# EAGLE design lab4 (EAGLE 7.6.0)
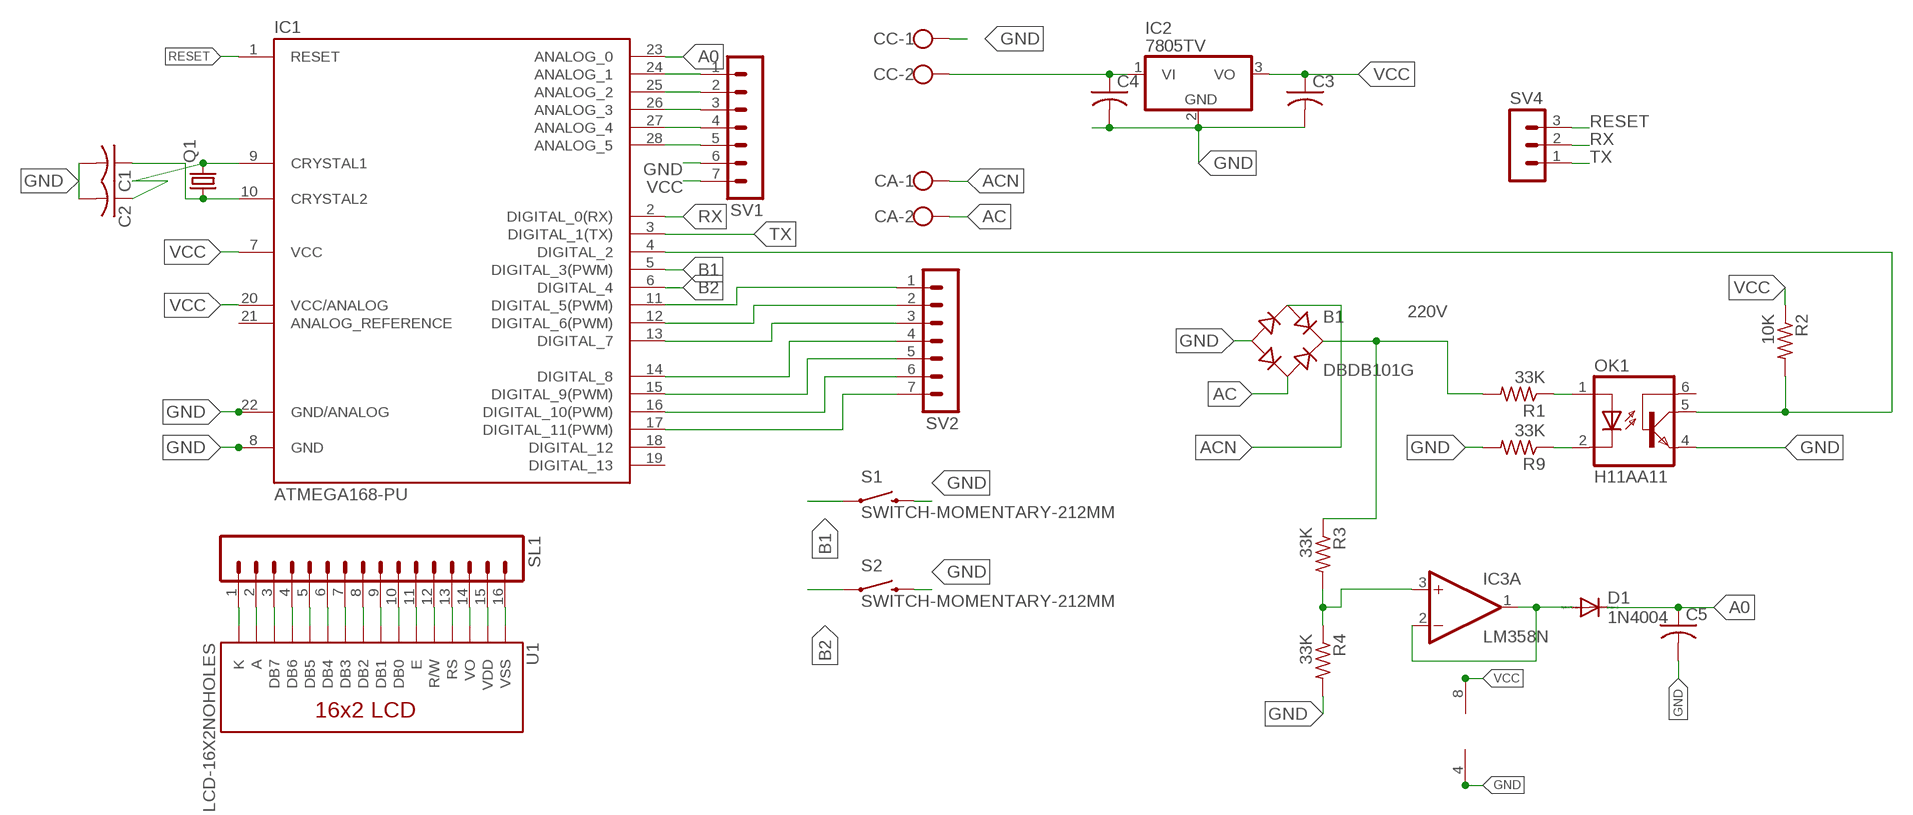
[diagram p0: schematic, sheet 1]

## Parts
B1  DBDB101G  [DB]
C1  C-US025-025X050  [C025-025X050]
C2  C-US025-025X050  [C025-025X050]
C3  C-US075-032X103  [C075-032X103]
C4  C-US050-025X075  [C050-025X075]
C5  C-US050-075X075  [C050-075X075]
CA  W237-102  [W237-102]
CC  W237-102  [W237-102]
D1  1N4004  [DO41-10]
IC1  ATMEGA168-PU  [DIL28-3]
IC2  7805TV  [TO220V]
IC3  LM358N  [DIL08]
OK1  H11AA11  [DIL06]
Q1  CRYSTALHC18U-V  [HC18U-V]
R1  33K  R-US_0207/7  [0207/7]
R2  10K  R-US_0309/12  [0309/12]
R3  33K  R-US_0207/7  [0207/7]
R4  33K  R-US_0207/7  [0207/7]
R9  33K  R-US_0207/7  [0207/7]
S1  SWITCH-MOMENTARY-212MM  [TACTILE-PTH-12MM]
S2  SWITCH-MOMENTARY-212MM  [TACTILE-PTH-12MM]
SL1  MA16  [16PA]
SV1  MA07-1  [MA07-1]
SV2  MA07-1  [MA07-1]
SV4  MA03-1  [MA03-1]
U1  LCD-16X2NOHOLES  [LCD-16X2_NOHOLES]

## Nets
220V: B1.+ R1.2 R3.1
A0: C5.1 D1.C IC1.23(ANALOG_0)
AC: B1.AC2 CA.2
ACN: B1.AC1 CA.1
B1: IC1.5(DIGITAL_3(PWM)) S1.1
B2: IC1.6(DIGITAL_4) S2.1
DIG02: IC1.4(DIGITAL_2) OK1.5(COL) R2.2
GND: B1.- C1.2 C2.2 C3.2 C4.2 C5.2 CC.1 IC1.8(GND) IC1.22(GND/ANALOG) IC2.2(GND) IC3.4(P:V-) OK1.4(EMI) R4.2 R9.2 S1.3 S2.3 SV1.6
N$1: IC1.24(ANALOG_1) SV1.1
N$2: D1.A IC3.1(A:OUT) IC3.2(A:-IN)
N$3: IC3.3(A:+IN) R3.2 R4.1
N$4: OK1.2(C) R9.1
N$5: IC1.11(DIGITAL_5(PWM)) SV2.1
N$6: OK1.1(A) R1.1
N$7: IC1.25(ANALOG_2) SV1.2
N$8: C2.1 IC1.9(CRYSTAL1) Q1.2
N$9: C1.1 IC1.10(CRYSTAL2) Q1.1
N$10: IC1.12(DIGITAL_6(PWM)) SV2.2
N$11: IC1.13(DIGITAL_7) SV2.3
N$12: C4.1 CC.2 IC2.1(VI)
N$13: IC1.14(DIGITAL_8) SV2.4
N$14: IC1.15(DIGITAL_9(PWM)) SV2.5
N$15: IC1.16(DIGITAL_10(PWM)) SV2.6
N$16: IC1.26(ANALOG_3) SV1.3
N$17: IC1.17(DIGITAL_11(PWM)) SV2.7
N$18: IC1.27(ANALOG_4) SV1.4
N$19: IC1.28(ANALOG_5) SV1.5
N$20: SL1.1 U1.16(K)
N$21: SL1.2 U1.15(A)
N$22: SL1.3 U1.14(DB7)
N$23: SL1.4 U1.13(DB6)
N$24: SL1.5 U1.12(DB5)
N$25: SL1.6 U1.11(DB4)
N$26: SL1.7 U1.10(DB3)
N$27: SL1.8 U1.9(DB2)
N$28: SL1.9 U1.8(DB1)
N$29: SL1.10 U1.7(DB0)
N$30: SL1.11 U1.6(E)
N$31: SL1.12 U1.5(R/W)
N$32: SL1.13 U1.4(RS)
N$33: SL1.14 U1.3(VO)
N$34: SL1.15 U1.2(VDD)
N$35: SL1.16 U1.1(VSS)
RESET: IC1.1(RESET) SV4.3
RX: IC1.2(DIGITAL_0(RX)) SV4.2
TX: IC1.3(DIGITAL_1(TX)) SV4.1
VCC: C3.1 IC1.7(VCC) IC1.20(VCC/ANALOG) IC2.3(VO) IC3.8(P:V+) R2.1 SV1.7
Unconnected: IC1.18(DIGITAL_12) IC1.19(DIGITAL_13) IC1.21(ANALOG_REFERENCE) IC3.5(B:+IN) IC3.6(B:-IN) IC3.7(B:OUT) OK1.6(BAS)

## Library data of the parts
B1 = rectifier:DB?*G: Single Phase 1.0 AMP Glass Passivated Bridge Rectifier Taiwan Semiconductor Co.,Ltd. - TSC Source: http://www.taiwansemi.com/TSCbig5/ezcatfiles/cust/img/img/db101g.pdf http://www.ts.com.tw/db/pictures/modules/PDT/PDT060207001/DBLS201G.pdf
C1-C5 = adafruit:C-US: CAPACITOR, American symbol
CA CC = con-wago-500:W237-102: WAGO SCREW CLAMP; MPN: 237-102; OC_FARNELL: unknown; OC_NEWARK: 70K9898
D1 = diode:1N4004: DIODE general purpose rectifier, 1 A
IC1 = Arduino-AVR:ATMEGA168-PU
IC2 = linear:78*: Positive VOLTAGE REGULATOR Source: http://cache.national.com/ds/LM/LM78L05.pdf http://www.fairchildsemi.com/ds/LM/LM7805.pdf
IC3 = linear:LM358: OP AMP also LM158; LM258; LM2904 Source: http://cache.national.com/ds/LM/LM158.pdf
OK1 = twomey:H11AA1: Optocoupler AC Input 1 Channel Trans W/Base DC Output 6-Pin DIP Source: http://www.jameco.com/webapp/wcs/stores/servlet/Product_10001_10001_18825_-1; MPN: H11A1-M; OC_FARNELL: 1021358; OC_NEWARK: 97K1793
Q1 = adafruit:CRYSTAL: CRYSTAL; OC_FARNELL: unknown; OC_NEWARK: unknown
R1-R4 R9 = adafruit:R-US_: RESISTOR, American symbol
S1 S2 = SparkFun-Electromechanical:SWITCH-MOMENTARY-2: Various NO switches- pushbuttons, reed, etc; PROD_ID: SWCH-09185
SL1 = con-amp-quick:MA16: AMP QUICK CONNECTOR; OC_FARNELL: unknown; OC_NEWARK: unknown
SV1 SV2 = con-lstb:MA07-1: PIN HEADER; OC_FARNELL: unknown; OC_NEWARK: unknown
SV4 = con-lstb:MA03-1: PIN HEADER; OC_FARNELL: unknown; OC_NEWARK: unknown
U1 = SparkFun-Displays:LCD-16X2: Standard text-only 16x2 parallel input LCD

## Board
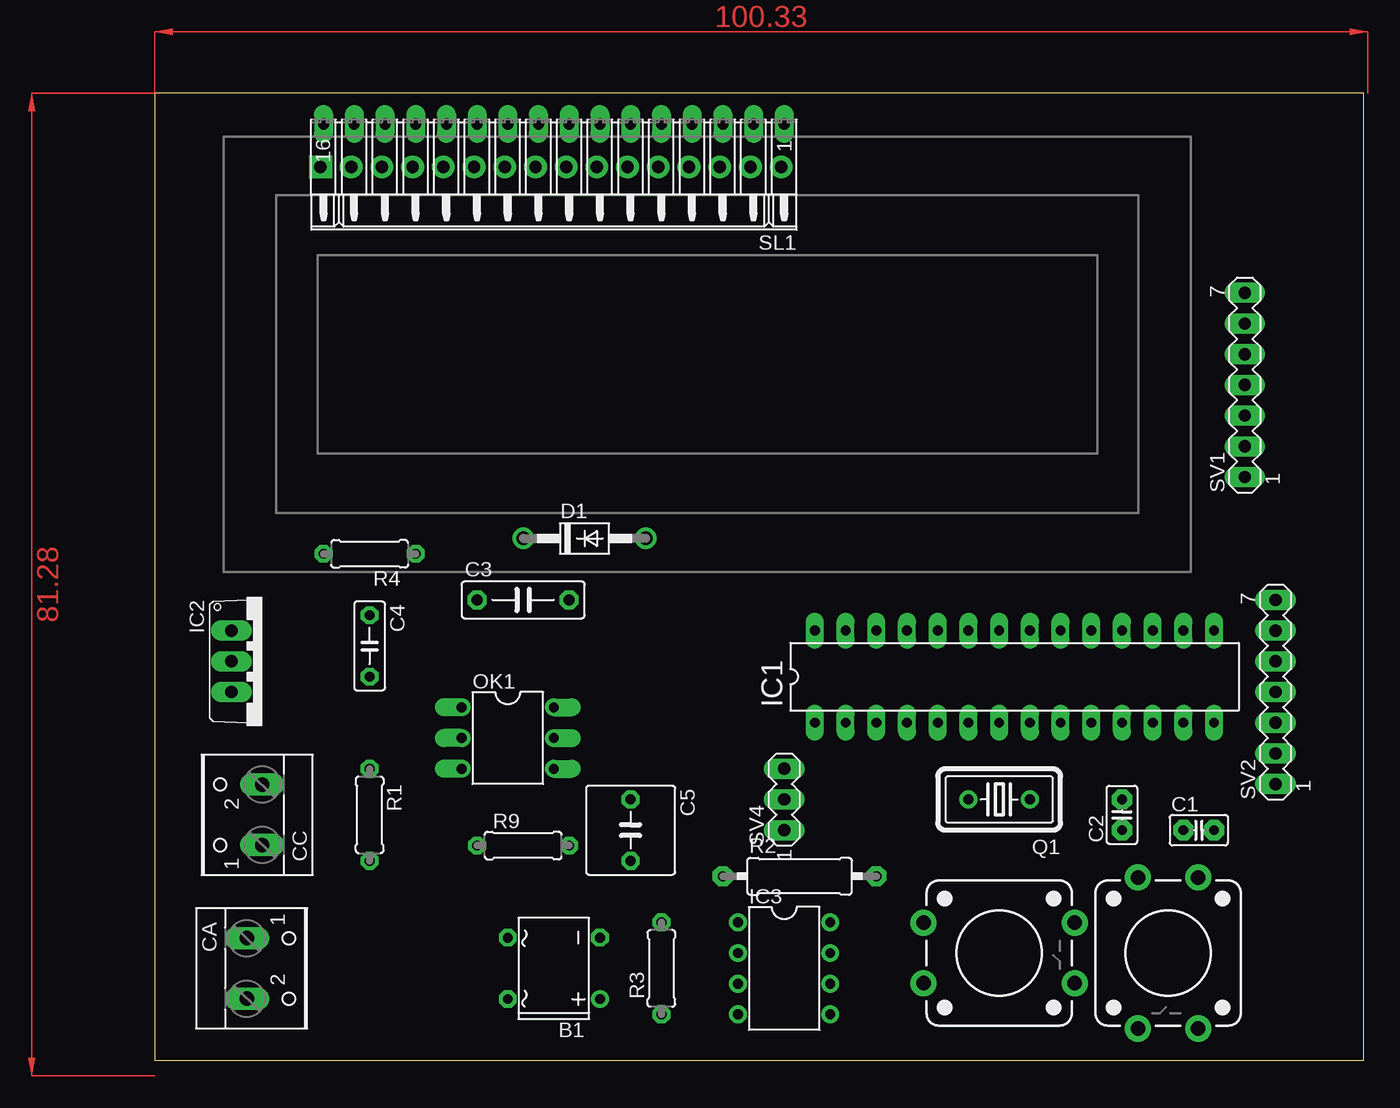
[diagram p1: board, top side]
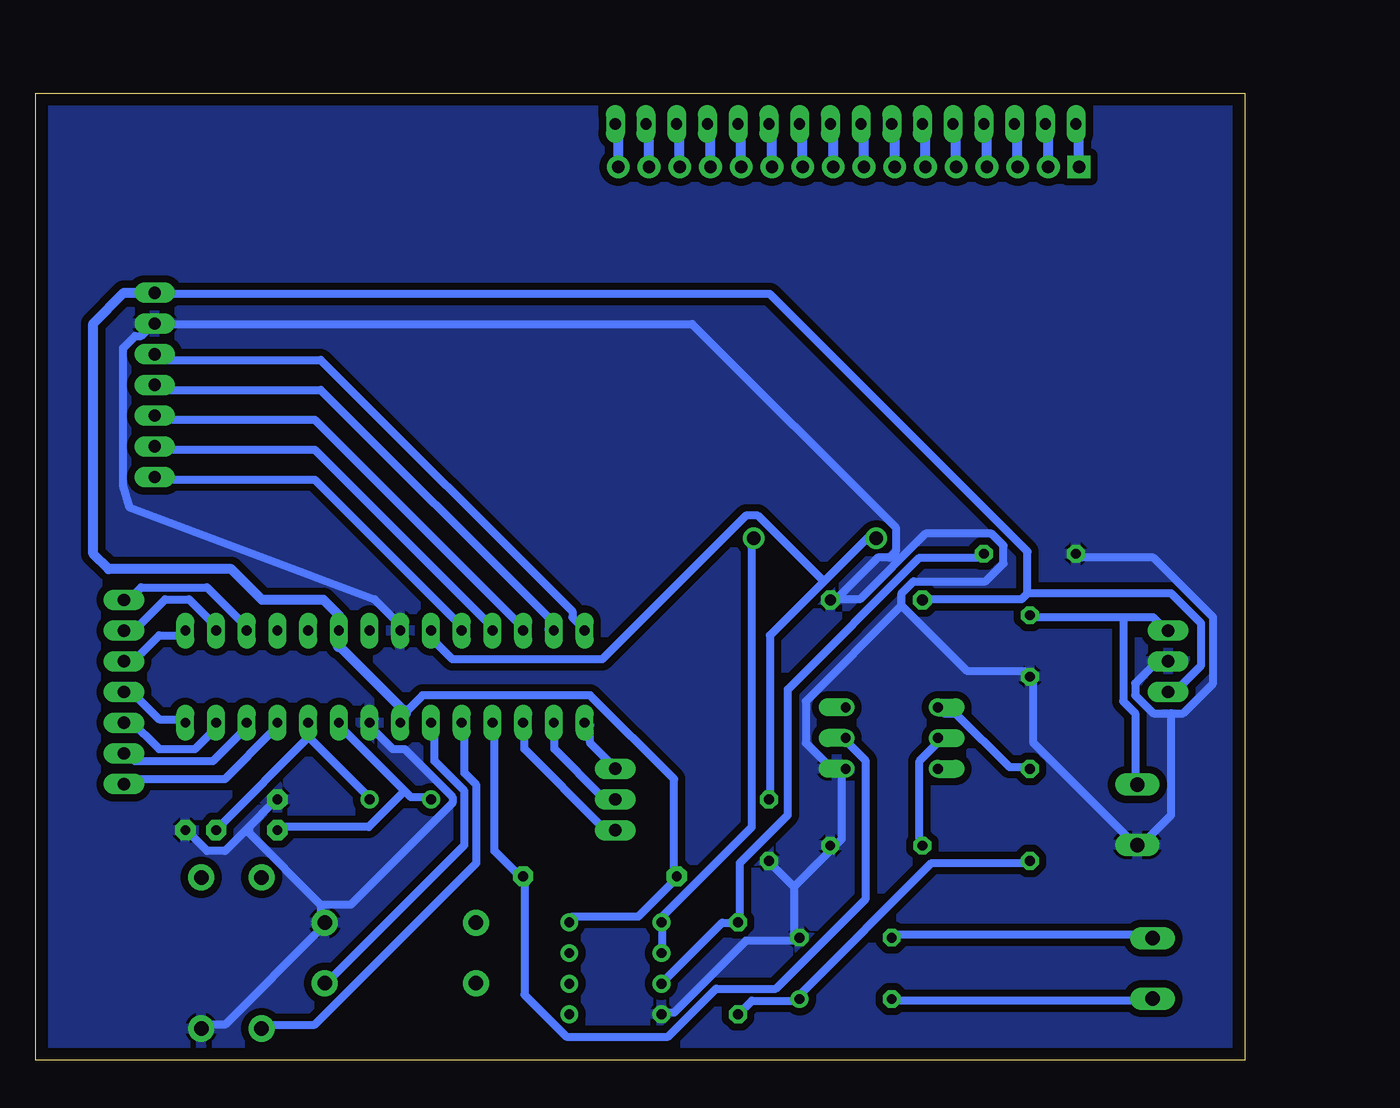
[diagram p2: board, bottom side, seen from below]

Size 100 x 80 mm. Coordinates in mm from the lower left corner, seen from the top.
Outline: 0,0 100,0 100,80 0,80 0,0
Copper layers (1*16): Top 0.035mm / dielectric 1.5mm / Bottom 0.035mm
Design rules "default *": minimum track width 26mil, minimum drill 26mil, track to track 13mil, track to pad 13mil, pad to pad 13mil, via to via 13mil, smd to smd 13mil, copper to edge 40mil, drill to drill 8mil, minimum pad ring 13mil, minimum via ring 13mil, stop-mask expansion 4mil, vias tented up to drill 0mil, thermal gap 10mil

### Footprints (pad centres in the part's own frame; a part is rotated, then mirrored left to right if it is on the bottom)
DB = drill 0.813: + -2.54,-3.81 | drill 0.813 octagon: - 2.54,-3.81; AC1 2.54,3.81; AC2 -2.54,3.81
C025-025X050 = drill 0.813 pad 1.676 octagon: 1 -1.27,0; 2 1.27,0
C075-032X103 = drill 0.914 octagon: 1 -3.81,0; 2 3.81,0
C050-025X075 = drill 0.813 octagon: 1 -2.54,0; 2 2.54,0
C050-075X075 = drill 0.813 octagon: 1 -2.54,0; 2 2.54,0
W237-102 = drill 1.194 long: 1 -2.5,-1.27; 2 2.5,-1.27
DO41-10 = drill 1.118: A 5.08,0; C -5.08,0
DIL28-3 = drill 0.813 long: 1 -16.51,-3.81; 2 -13.97,-3.81; 3 -11.43,-3.81; 4 -8.89,-3.81; 5 -6.35,-3.81; 6 -3.81,-3.81; 7 -1.27,-3.81; 8 1.27,-3.81; 9 3.81,-3.81; 10 6.35,-3.81; 11 8.89,-3.81; 12 11.43,-3.81; 13 13.97,-3.81; 14 16.51,-3.81; 15 16.51,3.81; 16 13.97,3.81; 17 11.43,3.81; 18 8.89,3.81; 19 6.35,3.81; 20 3.81,3.81; 21 1.27,3.81; 22 -1.27,3.81; 23 -3.81,3.81; 24 -6.35,3.81; 25 -8.89,3.81; 26 -11.43,3.81; 27 -13.97,3.81; 28 -16.51,3.81
TO220V = drill 1.016 long: 1 -2.54,-2.54; 2 0,-2.54; 3 2.54,-2.54
DIL08 = drill 0.813 pad 1.27: 1 -3.81,-3.81; 2 -1.27,-3.81; 3 1.27,-3.81; 4 3.81,-3.81; 5 3.81,3.81; 6 1.27,3.81; 7 -1.27,3.81; 8 -3.81,3.81
DIL06 = drill 0.813 offset: 1 -2.54,-3.81; 2 0,-3.81; 3 2.54,-3.81; 4 2.54,3.81; 5 0,3.81; 6 -2.54,3.81
HC18U-V = drill 0.813: 1 -2.54,0; 2 2.54,0
0207/7 = drill 0.813 octagon: 1 -3.81,0; 2 3.81,0
0309/12 = drill 0.813 pad 1.676 octagon: 1 -6.35,0; 2 6.35,0
TACTILE-PTH-12MM = drill 1.2 pad 2.159: 1 6.25,-2.5; 2 -6.25,-2.5; 3 6.25,2.5; 4 -6.25,2.5
16PA = drill 0.914 long: 1 -19.05,0; 2 -16.51,0; 3 -13.97,0; 4 -11.43,0; 5 -8.89,0; 6 -6.35,0; 7 -3.81,0; 8 -1.27,0; 9 1.27,0; 10 3.81,0; 11 6.35,0; 12 8.89,0; 13 11.43,0; 14 13.97,0; 15 16.51,0; 16 19.05,0
MA07-1 = drill 1.016 long: 1 -7.62,0; 2 -5.08,0; 3 -2.54,0; 4 0,0; 5 2.54,0; 6 5.08,0; 7 7.62,0
MA03-1 = drill 1.016 long: 1 -2.54,0; 2 0,0; 3 2.54,0
LCD-16X2_NOHOLES = drill 1.016 pad 1.88 square: 1 -32,15.5 | drill 1.016 pad 1.88: 2 -29.46,15.5; 3 -26.92,15.5; 4 -24.38,15.5; 5 -21.84,15.5; 6 -19.3,15.5; 7 -16.76,15.5; 8 -14.22,15.5; 9 -11.68,15.5; 10 -9.14,15.5; 11 -6.6,15.5; 12 -4.06,15.5; 13 -1.52,15.5; 14 1.02,15.5; 15 3.56,15.5; 16 6.1,15.5

### Placement (x,y rotation side)
B1  33.02,7.62 90 top
C1  86.36,19.05 0 top
C2  80.01,20.32 90 top
C3  30.48,38.1 0 top
C4  17.78,34.29 270 top
C5  39.37,19.05 270 top
CA  8.89,7.62 270 top
CC  7.62,20.32 90 top
D1  35.56,43.18 0 top
IC1  71.12,31.75 0 top
IC2  8.89,33.02 270 top
IC3  52.07,7.62 270 top
OK1  29.21,26.67 270 top
Q1  69.85,21.59 180 top
R1  17.78,20.32 270 top
R2  53.34,15.24 0 top
R3  41.91,7.62 90 top
R4  17.78,41.91 180 top
R9  30.48,17.78 0 top
S1  83.82,8.89 270 top
S2  69.85,8.89 0 top
SL1  33.02,77.47 180 top
SV1  90.17,55.88 90 top
SV2  92.71,30.48 90 top
SV4  52.07,21.59 90 top
U1  45.72,58.42 0 top

### Tracks (layer width: path | path; a pad name or v marks a point on that pad's centre or on a via)
220V
  Bottom 0.66: R3.1 40.77,4.95 37.3,4.95 B1.+ 36.8,5.45 25.91,16.34 17.98,16.34 R1.2
A0
  Bottom 0.66: 34.82,39.62 30.86,43.59 D1.C | 34.82,39.62 39.28,35.17 39.28,21.79 C5.1 | 34.82,39.62 40.27,45.07 41.26,45.07 53.15,33.19 65.53,33.19 67.02,34.67 67.02,35.17 IC1.23
AC
  Bottom 0.66: B1.AC2 28.88,4.95 8.08,4.95 CA.2
ACN
  Bottom 0.66: B1.AC1 28.88,10.4 8.08,10.4 CA.1
B1
  Bottom 0.66: IC1.5 64.54,27.74 64.54,23.77 63.55,22.78 63.55,16.34 76.92,2.97 80.89,2.97 S1.1
B2
  Bottom 0.66: IC1.6 67.02,27.74 67.02,24.77 64.54,22.29 64.54,17.83 75.93,6.44 S2.1
DIG02
  Bottom 0.66: OK1.5 32.84,26.25 31.36,24.77 31.36,13.37 38.79,5.94 43.74,5.94 47.7,1.98 56.12,1.98 59.59,5.45 59.59,14.86 R2.2 60.08,15.35 62.06,17.34 62.06,27.74 IC1.4
GND
  Bottom 0.66: 37.3,14.36 37.3,10.4 B1.- 37.3,9.91 41.26,9.91 47.21,3.96 48.2,3.96 IC3.4 | 37.3,14.36 39.28,16.34 C5.2 | 37.3,14.36 34.33,17.34 R9.2 33.83,17.83 33.34,18.33 33.34,23.77 OK1.4 33.34,24.27 34.33,24.27 36.31,26.25 36.31,29.72 28.38,37.64 | 6.1,28.73 7.58,28.73 9.07,30.21 9.07,31.2 7.58,32.69 6.59,32.69 IC2.2 | 6.1,28.73 5.11,28.73 2.63,31.2 2.63,36.65 7.58,41.6 13.53,41.6 R4.2 | 33.83,38.14 31.85,38.14 26.4,43.59 20.95,43.59 19.96,42.6 19.96,41.11 21.45,39.62 27.39,39.62 28.38,38.63 28.38,37.64 | 28.38,37.64 22.94,32.19 17.98,32.19 C4.2 17.49,31.7 17.49,26.25 9.07,17.83 CC.1 8.57,17.83 6.1,20.31 6.1,28.73 | 82.37,19.32 80.39,21.3 C2.2 | 82.37,19.32 84.35,17.34 85.84,17.34 87.33,18.82 C1.2 | 76.43,12.88 76.43,11.39 S2.3 76.43,10.9 84.35,2.97 85.84,2.97 S1.3 | 76.43,12.88 82.37,18.82 82.37,19.32 | 71.97,28.23 IC1.8 72.47,27.74 70.48,25.76 69.49,25.76 65.53,21.79 65.53,21.3 73.95,12.88 76.43,12.88 | 69.99,35.17 IC1.22 69.49,35.66 71.97,38.14 92.25,45.76 92.77,47.55 92.77,58.94 91.78,59.93 91.29,59.93 90.3,60.92 SV1.6 89.8,60.92 45.72,60.92 28.88,44.08 28.88,42.1 29.38,41.6 30.37,41.6 33.83,38.14 | 33.83,38.14 C3.2
  pour Bottom (isolate 0.61): 0,80.01 0,0 100.33,0 100.33,80.01
N$1
  Bottom 0.66: IC1.24 65.04,35.66 65.04,36.16 76.92,48.04 89.8,48.04 SV1.1
N$2
  Bottom 0.66: IC3.2 48.2,8.91 48.2,11.39 IC3.1 48.2,11.89 40.77,19.32 40.77,43.09 D1.A
N$3
  Bottom 0.66: IC3.3 48.2,6.44 43.24,11.39 42.25,11.39 R3.2 41.76,11.89 41.76,16.34 37.8,20.31 37.8,30.71 26.9,41.6 21.95,41.6 R4.1
N$4
  Bottom 0.66: OK1.2 25.41,26.25 26.9,24.77 26.9,17.83 R9.1
N$5
  Bottom 0.66: IC1.11 80.39,27.74 80.39,27.24 84.35,23.28 92.28,23.28 SV2.1
N$6
  Bottom 0.66: R1.1 17.98,24.27 19.47,24.27 23.93,28.73 24.92,28.73 OK1.1
N$7
  Bottom 0.66: IC1.25 62.56,35.66 62.56,36.16 76.92,50.52 89.8,50.52 SV1.2
N$8
  Bottom 0.66: 69.49,22.29 74.94,27.74 IC1.9 | 69.49,22.29 69,21.79 67.51,21.79 Q1.2 | 69.49,22.29 72.47,19.32 79.9,19.32 C2.1
N$9
  Bottom 0.66: 77.42,26.75 72.47,21.79 Q1.1 | 77.42,26.75 77.42,27.74 IC1.10 77.42,26.75 | 77.42,26.75 84.85,19.32 C1.1
N$10
  Bottom 0.66: IC1.12 82.87,27.74 82.87,27.24 85.34,24.77 91.78,24.77 92.28,25.26 SV2.2
N$11
  Bottom 0.66: IC1.13 85.34,27.74 85.34,27.24 86.83,25.76 89.8,25.76 92.28,28.23 SV2.3
N$12
  Bottom 0.66: 10.06,36.65 7.58,36.65 6.59,35.66 IC2.1 | 10.06,36.65 17.49,36.65 C4.1 | 10.06,36.65 10.06,29.72 9.07,28.73 9.07,23.28 CC.2
N$13
  Bottom 0.66: IC1.14 87.82,28.23 89.8,28.23 92.28,30.71 SV2.4
N$14
  Bottom 0.66: IC1.15 87.82,35.17 89.8,35.17 92.28,32.69 SV2.5
N$15
  Bottom 0.66: IC1.16 85.34,35.66 85.34,36.16 87.33,38.14 89.31,38.14 92.28,35.17 SV2.6
N$16
  Bottom 0.66: IC1.26 60.08,35.66 60.08,36.16 76.92,53 89.8,53 SV1.3
N$17
  Bottom 0.66: IC1.17 82.87,35.66 82.87,36.16 85.84,39.13 91.29,39.13 92.28,38.14 SV2.7
N$18
  Bottom 0.66: IC1.27 57.61,35.66 57.61,36.65 76.43,55.47 89.8,55.47 SV1.4
N$19
  Bottom 0.66: IC1.28 54.63,35.66 55.63,36.65 55.63,37.15 76.43,57.95 89.8,57.95 SV1.5
N$20
  Bottom 0.813: U1.16 51.82,77.22 SL1.1
N$21
  Bottom 0.813: U1.15 49.28,77.22 SL1.2
N$22
  Bottom 0.813: U1.14 46.74,77.22 SL1.3
N$23
  Bottom 0.813: U1.13 44.2,77.22 SL1.4
N$24
  Bottom 0.813: U1.12 41.66,77.22 SL1.5
N$25
  Bottom 0.813: U1.11 39.12,77.22 SL1.6
N$26
  Bottom 0.813: U1.10 36.58,77.22 SL1.7
N$27
  Bottom 0.813: U1.9 34.04,77.22 SL1.8
N$28
  Bottom 0.813: U1.8 31.5,77.22 SL1.9
N$29
  Bottom 0.813: U1.7 28.96,77.22 SL1.10
N$30
  Bottom 0.813: U1.6 26.42,77.22 SL1.11
N$31
  Bottom 0.813: U1.5 23.88,77.22 SL1.12
N$32
  Bottom 0.813: U1.4 21.34,77.22 SL1.13
N$33
  Bottom 0.813: U1.3 18.8,77.22 SL1.14
N$34
  Bottom 0.813: U1.2 16.26,77.22 SL1.15
N$35
  Bottom 0.813: U1.1 13.72,77.22 SL1.16
RESET
  Bottom 0.66: IC1.1 54.14,27.74 54.14,26.25 52.16,24.27 SV4.3
RX
  Bottom 0.66: IC1.2 57.11,27.74 57.11,25.76 53.15,21.79 52.16,21.79 SV4.2
TX
  Bottom 0.66: IC1.3 59.59,27.74 59.59,25.76 53.15,19.32 52.16,19.32 SV4.1
VCC
  Bottom 0.66: IC3.8 55.63,11.89 50.18,11.89 47.21,14.86 R2.1 47.21,15.35 47.21,23.28 54.14,30.21 68.01,30.21 69.49,28.73 69.49,28.23 IC1.7 | 17.98,38.63 18.48,38.14 26.4,38.14 C3.1 | 17.98,38.63 6.1,38.63 3.62,36.16 3.62,32.69 6.1,30.21 IC2.3 | 17.98,38.63 17.98,42.1 39.28,63.4 89.8,63.4 SV1.7
  Bottom 0.813: SV1.7 92.71,63.5 95.25,60.96 95.25,41.91 93.98,40.64 83.82,40.64 81.28,38.1 76.2,38.1 74.93,36.83 74.93,34.29 69.49,28.85
  Bottom 1.016: 69.49,28.73 69.49,28.85 | 74.93,34.29 IC1.20
(copper drawn outside any net)
  shapes: Top area x2